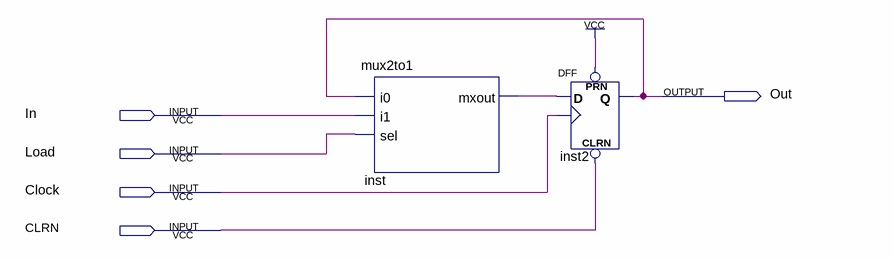
[diagram p0: schematic sheet]
// Quartus schematic register.bdf as structural Verilog: 2 symbols, 5 pins
module register (
  input  In,
  input  Load,
  input  Clock,
  input  CLRN,
  output Out
);

  wire inst_mxout;

  mux2to1 inst (.i0(Out), .i1(In), .sel(Load), .mxout(inst_mxout));
  DFF inst2 (.CLRN(CLRN), .CLK(Clock), .D(inst_mxout), .PRN(1'b1), .Q(Out));
endmodule
